# Altium project ek-ra8d2_mp - Customer.PrjPcb (part 5 of 5)
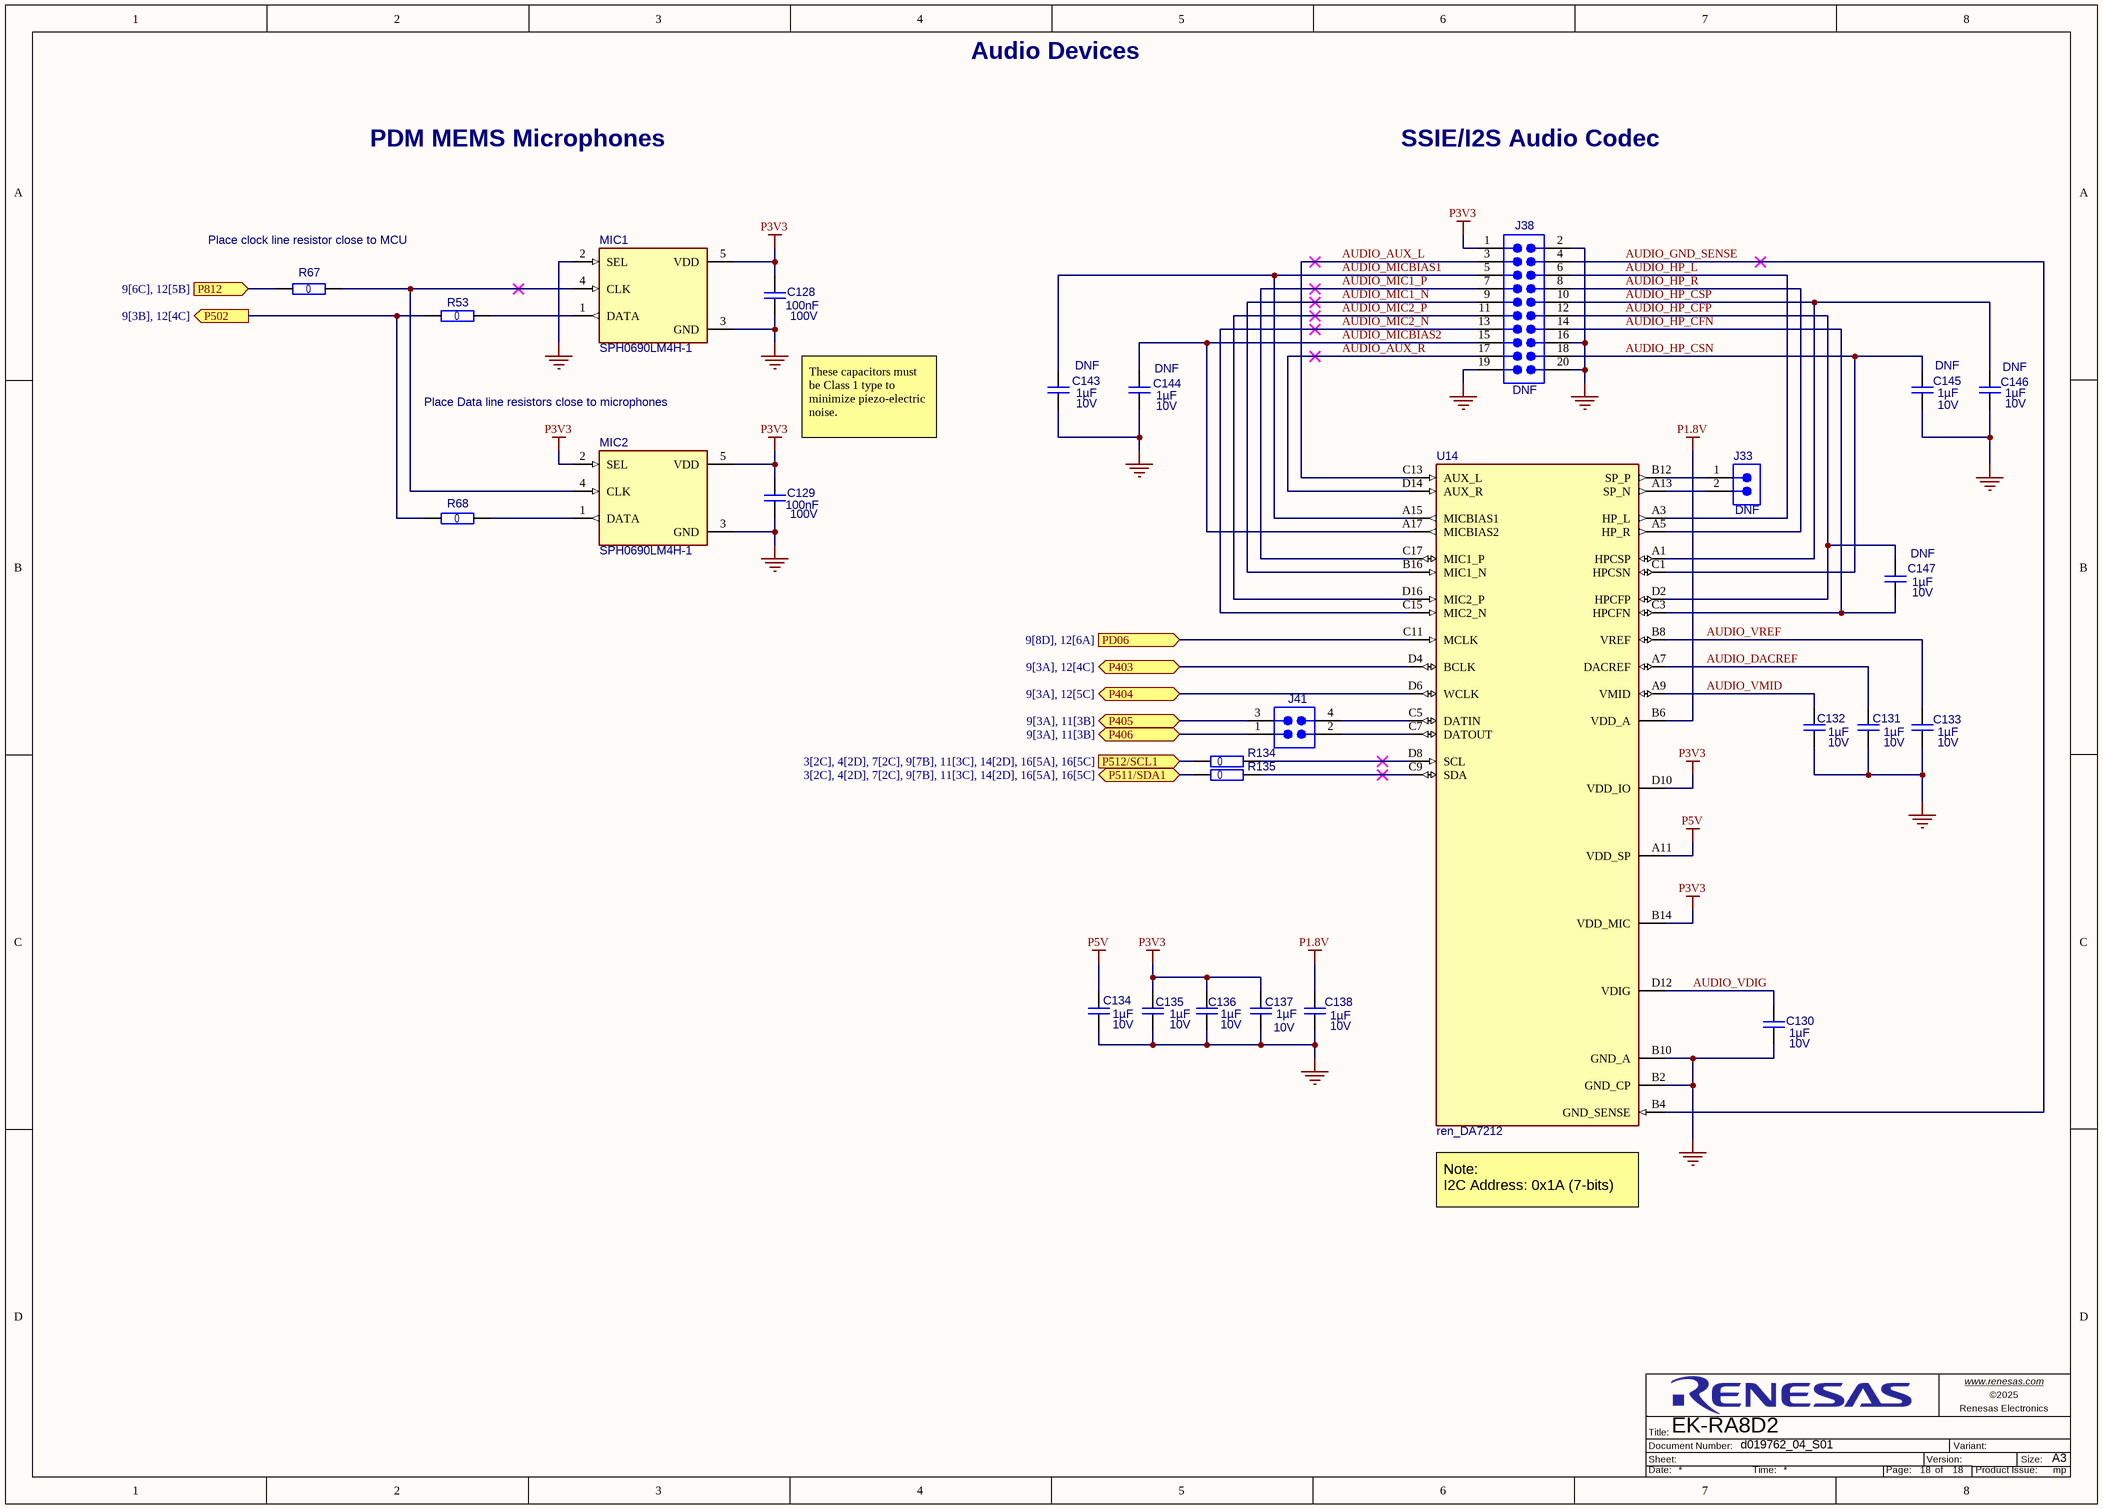
[diagram p18: Audio Devices.SchDoc]

## Nets that join several sheets
GND: Power Supply (23 pins), HMI Features (23 pins), USB Full Speed (34 pins), Arduino Shield Connection (6 pins), mikroBUS Connection (J21.8 J22.8), Pmod, Grove and Qwiic Connections (32 pins), J-Link On Board with RA4M2 (45 pins), RA8D2 MCU - Ports (18 pins), RA8D2 MCU - Power (71 pins), CEU Camera (28 pins), Pin Headers (J2.39 J3.39 J4.19 J17.19), Gigabit Ethernet (39 pins), USB High Speed (27 pins), Octal SPI Flash (34 pins), MIPI Interface and Parallel Display Interface (10 pins), SDRAM (29 pins), Audio Devices (24 pins)
P1.8V: Power Supply (6 pins), RA8D2 MCU - Power (C48.1 R86.1), MIPI Interface and Parallel Display Interface (J32.21 J32.22), Audio Devices (C138.1 U14.B6)
P3V3: Power Supply (13 pins), HMI Features (18 pins), USB Full Speed (9 pins), Arduino Shield Connection (C36.2 J18.2 J18.4 U5.20), mikroBUS Connection (J21.7), Pmod, Grove and Qwiic Connections (21 pins), J-Link On Board with RA4M2 (J13.1 J20.1 R15.2), RA8D2 MCU - Ports (9 pins), RA8D2 MCU - Power (5 pins), CEU Camera (9 pins), Pin Headers (J2.1 J3.1 J4.1 J17.1), Gigabit Ethernet (20 pins), USB High Speed (7 pins), Octal SPI Flash (30 pins), MIPI Interface and Parallel Display Interface (J1.5 J1.7 J32.23 J32.24), SDRAM (65 pins), Audio Devices (11 pins)
P3V3_MCU: RA8D2 MCU - Power (26 pins), Pin Headers (J2.40)
P3V3_USB: RA8D2 MCU - Power (8 pins), Pin Headers (J3.2)
P3V3JLOB: Power Supply (E29.2), J-Link On Board with RA4M2 (19 pins)
P5V: Power Supply (15 pins), USB Full Speed (Q1.3,7 U16.5), Arduino Shield Connection (J18.5), mikroBUS Connection (J22.7), Pmod, Grove and Qwiic Connections (E35.2), Pin Headers (J4.2), USB High Speed (Q11.3,7 U17.5), MIPI Interface and Parallel Display Interface (J1.8 J32.25 J32.26), Audio Devices (C134.1 U14.A11)
P5V_USB_DBG: Power Supply (D3.2 E59.2), J-Link On Board with RA4M2 (7 pins)
USBFS_cVBUS: Power Supply (D4.2 E60.2), USB Full Speed (6 pins)
USBHS_cVBUS: Power Supply (D6.2 E61.2), USB Full Speed (R90.2), USB High Speed (5 pins)
VSS_USBHS: RA8D2 MCU - Ports (R80.1), RA8D2 MCU - Power (8 pins)
ARD_MB_MISOB: Arduino Shield Connection (J24.5 U5.15), mikroBUS Connection (J21.5)
ARD_MB_MOSIB: Arduino Shield Connection (J24.4 U5.16), mikroBUS Connection (J21.6)
ARD_MB_RSPCKB: Arduino Shield Connection (J24.6 U5.17), mikroBUS Connection (J21.4)
ARD_MB_RXD: Arduino Shield Connection (J23.1 U5.14), mikroBUS Connection (J22.3)
ARD_MB_SSLB0: Arduino Shield Connection (J24.3 U5.18), mikroBUS Connection (J21.3)
ARD_MB_TXD: Arduino Shield Connection (J23.2 U5.13), mikroBUS Connection (J22.4)
ARDUINO_AREF: Arduino Shield Connection (J24.8), RA8D2 MCU - Power (E43.2)
ARDUINO_OE_L: HMI Features (RA1.4 SW4.4 U15.7), Arduino Shield Connection (R23.1 U5.19)
AVCC0: RA8D2 MCU - Power (C9.1 C10.2 E3.1 U1.R9), Pin Headers (J4.3)
AVSS0: RA8D2 MCU - Power (C9.2 C10.1 E4.2 U1.R10), Pin Headers (J4.5)
I3C_SEL_L: HMI Features (RA1.5 SW4.5 U15.6), RA8D2 MCU - Ports (U20.1)
MIPI_CSI_CL_N: RA8D2 MCU - Ports (U21.E1), CEU Camera (J35.9 U23.15)
MIPI_CSI_CL_P: RA8D2 MCU - Ports (U21.E2), CEU Camera (J35.8 U23.16)
MIPI_CSI_DL0_N: RA8D2 MCU - Ports (U21.D2), CEU Camera (J35.12 U23.13)
MIPI_CSI_DL0_P: RA8D2 MCU - Ports (U21.D1), CEU Camera (J35.11 U23.14)
MIPI_CSI_DL1_N: RA8D2 MCU - Ports (U21.F1), CEU Camera (J35.6 U23.17)
MIPI_CSI_DL1_P: RA8D2 MCU - Ports (U21.F2), CEU Camera (J35.5 U23.18)
MIPI_DSI_CL_N: RA8D2 MCU - Ports (U21.E3), MIPI Interface and Parallel Display Interface (J32.11)
MIPI_DSI_CL_P: RA8D2 MCU - Ports (U21.E4), MIPI Interface and Parallel Display Interface (J32.9)
MIPI_DSI_DL0_N: RA8D2 MCU - Ports (U21.D4), MIPI Interface and Parallel Display Interface (J32.5)
MIPI_DSI_DL0_P: RA8D2 MCU - Ports (U21.D3), MIPI Interface and Parallel Display Interface (J32.3)
MIPI_DSI_DL1_N: RA8D2 MCU - Ports (U21.F3), MIPI Interface and Parallel Display Interface (J32.6)
MIPI_DSI_DL1_P: RA8D2 MCU - Ports (U21.F4), MIPI Interface and Parallel Display Interface (J32.4)
MIPI_SEL: HMI Features (RA1.6 SW4.6 U15.5), RA8D2 MCU - Ports (U21.A6), CEU Camera (R66.1 R70.1 U22.19 U23.19)
OSPI_OE_L: HMI Features (RA1.3 SW4.3 U15.8), Octal SPI Flash (6 pins)
P000: HMI Features (R123.1 U15.1), RA8D2 MCU - Ports (U1.U13), Pin Headers (J2.15)
P001: Arduino Shield Connection (J19.1), RA8D2 MCU - Ports (U1.T13), Pin Headers (J2.11)
P002: Pmod, Grove and Qwiic Connections (E42.1), RA8D2 MCU - Ports (U1.U14), Pin Headers (J2.10)
P003: Arduino Shield Connection (J19.3), RA8D2 MCU - Ports (U1.R12), Pin Headers (J2.14)
P004: Arduino Shield Connection (J19.4), mikroBUS Connection (J21.1), RA8D2 MCU - Ports (U1.T11), Pin Headers (J2.6)
P005: Pmod, Grove and Qwiic Connections (E41.1), RA8D2 MCU - Ports (U1.R11), Pin Headers (J2.8)
P006: Pmod, Grove and Qwiic Connections (J26.7 R137.1), RA8D2 MCU - Ports (U1.U12), Pin Headers (J2.9)
P007: Arduino Shield Connection (J19.2), RA8D2 MCU - Ports (U1.T12), Pin Headers (J2.16)
P008: HMI Features (E32.1), RA8D2 MCU - Ports (U1.U11), Pin Headers (J2.7)
P009: HMI Features (E31.1), RA8D2 MCU - Ports (U1.P11), Pin Headers (J2.18)
P010: RA8D2 MCU - Ports (U1.P10), CEU Camera (J35.28), Pin Headers (J2.17)
P011: Arduino Shield Connection (J23.3), RA8D2 MCU - Ports (U1.N10), Pin Headers (J2.20)
P012: Pmod, Grove and Qwiic Connections (J25.7 R138.1), RA8D2 MCU - Ports (U1.P9), Pin Headers (J2.25)
P013: RA8D2 MCU - Ports (U1.N9), Pin Headers (J2.26)
P014: Arduino Shield Connection (J19.5), RA8D2 MCU - Ports (U1.T8), Pin Headers (J2.4)
P015: Arduino Shield Connection (J19.6), RA8D2 MCU - Ports (U1.U8), Pin Headers (J2.5)
P100: Arduino Shield Connection (U5.5), Pin Headers (J2.2), Octal SPI Flash (U25.14)
P100_MCU: RA8D2 MCU - Ports (U1.U6), Octal SPI Flash (U13.5 U25.6)
P101: Arduino Shield Connection (U5.4), Pin Headers (J2.12), Octal SPI Flash (U25.17)
P101_MCU: RA8D2 MCU - Ports (U1.R5), Octal SPI Flash (U13.8 U25.3)
P102: Arduino Shield Connection (U5.3), Pin Headers (J2.13), Octal SPI Flash (U25.18)
P102_MCU: RA8D2 MCU - Ports (U1.P5), Octal SPI Flash (U13.9 U25.2)
P103: Arduino Shield Connection (U5.2), Pin Headers (J2.19), Octal SPI Flash (U25.16)
P103_MCU: RA8D2 MCU - Ports (U1.R4), Octal SPI Flash (U13.7 U25.4)
P104: Arduino Shield Connection (U5.9), Pin Headers (J2.22), Octal SPI Flash (U24.14)
P104_MCU: RA8D2 MCU - Ports (U1.M6), Octal SPI Flash (U12.5 U24.6)
P105: Arduino Shield Connection (U5.8), Pin Headers (J2.23), Octal SPI Flash (U24.12)
P105_MCU: RA8D2 MCU - Ports (U1.N7), Octal SPI Flash (U12.3 U24.8)
P106: Pin Headers (J2.24), Octal SPI Flash (U24.11)
P106_MCU: RA8D2 MCU - Ports (U1.N6), Octal SPI Flash (U12.2 U24.9)
P107: RA8D2 MCU - Ports (U1.N5), Pin Headers (J2.29), Gigabit Ethernet (R113.2 U11.47)
P108: RA8D2 MCU - Ports (R71.2 U1.D8 U21.A5), Pin Headers (J2.30)
P109: RA8D2 MCU - Ports (R25.2 U1.D7), Pin Headers (J2.28)
P110: Arduino Shield Connection (J24.2), RA8D2 MCU - Ports (U1.C8), Pin Headers (J2.36)
P111: RA8D2 MCU - Ports (U1.E8), MIPI Interface and Parallel Display Interface (J1.3 J32.17)
P112: RA8D2 MCU - Ports (U1.A4), SDRAM (J37.23 RA10.1 U2.N8)
P113: RA8D2 MCU - Ports (U1.A2), SDRAM (J14.24 RA9.4 U2.P9)
P114: RA8D2 MCU - Ports (U1.B3), SDRAM (J37.21 RA9.3 U2.M8)
P115: RA8D2 MCU - Ports (U1.A3), SDRAM (J37.22 RA9.2 U2.M7)
P200/NMI: RA8D2 MCU - Ports (R14.1 U1.C5), Pin Headers (J2.38)
P201/MD: HMI Features (J16.1 R31.1), mikroBUS Connection (J21.2), J-Link On Board with RA4M2 (J6.1), RA8D2 MCU - Power (U1.E6), Pin Headers (J3.14)
P206: RA8D2 MCU - Ports (U1.B15), Pin Headers (J2.35), Gigabit Ethernet (E38.1)
P207: RA8D2 MCU - Ports (U1.A17), MIPI Interface and Parallel Display Interface (J1.23)
P208: J-Link On Board with RA4M2 (J29.1), RA8D2 MCU - Ports (U1.C7), Pin Headers (J2.37)
P209: J-Link On Board with RA4M2 (J29.3), RA8D2 MCU - Ports (U1.E7), Pin Headers (J2.21)
P210: J-Link On Board with RA4M2 (J29.5), RA8D2 MCU - Ports (E51.2 U1.C6)
P210_EXT: RA8D2 MCU - Ports (E51.1), Pin Headers (J3.8)
P211: J-Link On Board with RA4M2 (J29.7), RA8D2 MCU - Ports (E52.2 U1.D6)
P211_EXT: RA8D2 MCU - Ports (E52.1), Pin Headers (J3.10)
P212: RA8D2 MCU - Power (E13.1), Pin Headers (J3.6)
P213: RA8D2 MCU - Power (E12.1), Pin Headers (J3.5)
P214: RA8D2 MCU - Power (E58.1), Pin Headers (J17.9)
P215: RA8D2 MCU - Power (E57.1), Pin Headers (J17.12)
P300: RA8D2 MCU - Ports (U1.B5), SDRAM (J37.26 RA10.2 U2.R9)
P301: RA8D2 MCU - Ports (U1.C4), SDRAM (J37.17 RA10.3 U2.N7)
P302: RA8D2 MCU - Ports (U1.A5), SDRAM (J37.25 RA10.4 U2.R8)
P303: HMI Features (E26.1), RA8D2 MCU - Ports (U1.B6), Pin Headers (J3.33)
P304: J-Link On Board with RA4M2 (E44.1), RA8D2 MCU - Ports (R59.1), Pin Headers (J3.34), Gigabit Ethernet (E18.2)
P305: J-Link On Board with RA4M2 (E45.1), RA8D2 MCU - Ports (R60.1), Pin Headers (J3.35), Gigabit Ethernet (E19.2)
P306: J-Link On Board with RA4M2 (E46.1), RA8D2 MCU - Ports (R61.1), Pin Headers (J3.36), Gigabit Ethernet (E20.2)
P307: J-Link On Board with RA4M2 (E47.1), RA8D2 MCU - Ports (R62.1), Pin Headers (J3.37), Gigabit Ethernet (E21.2)
P308: J-Link On Board with RA4M2 (E48.1), RA8D2 MCU - Ports (U1.C9), Pin Headers (J3.32)
P309: RA8D2 MCU - Ports (R63.1), Pin Headers (J17.2), Gigabit Ethernet (E23.2)
P310: RA8D2 MCU - Ports (R64.1), Pin Headers (J3.40), Gigabit Ethernet (E22.2)
P311: RA8D2 MCU - Ports (R11.2 U1.B12), Pin Headers (J17.3)
P312: Arduino Shield Connection (J23.8), RA8D2 MCU - Ports (U1.C13), Pin Headers (J17.4)
P400: RA8D2 MCU - Ports (U20.3), CEU Camera (U23.9), Pin Headers (J17.6)
P401: RA8D2 MCU - Ports (U20.6), Pin Headers (J17.5)
P402: Pmod, Grove and Qwiic Connections (J26.8), RA8D2 MCU - Ports (U1.L14), Pin Headers (J17.14)
P403: RA8D2 MCU - Ports (U1.H13), Pin Headers (J17.7), Audio Devices (U14.D4)
P404: RA8D2 MCU - Ports (U1.J13), Pin Headers (J17.10), Audio Devices (U14.D6)
P405: RA8D2 MCU - Ports (U1.G12), CEU Camera (U23.7), Audio Devices (J41.3)
P406: RA8D2 MCU - Ports (U1.F14), CEU Camera (U23.6), Audio Devices (J41.1)
P407: USB Full Speed (U19.3 U19.6), RA8D2 MCU - Ports (U1.R17), Pin Headers (J17.11)
P408: USB Full Speed (U19.8 U19.11), RA8D2 MCU - Ports (U1.M15), Pin Headers (J17.18)
P409: Pmod, Grove and Qwiic Connections (J25.9), RA8D2 MCU - Ports (U1.R16), Pin Headers (J17.13)
P410: Pmod, Grove and Qwiic Connections (J25.8), RA8D2 MCU - Ports (U1.K13), Pin Headers (J17.16)
P411: RA8D2 MCU - Ports (U1.M14), Pin Headers (J17.15), MIPI Interface and Parallel Display Interface (J32.10)
P412: Pmod, Grove and Qwiic Connections (J26.9), RA8D2 MCU - Ports (U1.M12), Pin Headers (J17.17)
P413: Pmod, Grove and Qwiic Connections (J26.10), RA8D2 MCU - Ports (U1.P14), Pin Headers (J17.8)
P414: RA8D2 MCU - Ports (U1.L13), Pin Headers (J17.20), Gigabit Ethernet (R119.2 U11.42)
P415: RA8D2 MCU - Ports (U1.R15), Pin Headers (J4.17), Gigabit Ethernet (U11.41)
P500: USB Full Speed (Q2.1 R55.2 U19.4), RA8D2 MCU - Ports (U1.U7), Pin Headers (J4.16)
P501: RA8D2 MCU - Ports (U1.R8), CEU Camera (J35.26), Pin Headers (J4.18)
P502: RA8D2 MCU - Ports (U1.T7), Pin Headers (J4.15), Audio Devices (R53.1 R68.1)
P503: RA8D2 MCU - Ports (U1.H2), SDRAM (J37.14 RA18.1)
P504: RA8D2 MCU - Ports (U1.H1), SDRAM (J37.13 RA17.2)
P505: RA8D2 MCU - Ports (U1.H3), SDRAM (J14.15 RA17.1)
P506: RA8D2 MCU - Ports (U1.J1), SDRAM (J37.11 RA17.4)
P507: RA8D2 MCU - Ports (U1.J2), SDRAM (J37.12 RA17.3)
P508: RA8D2 MCU - Ports (U1.J3), SDRAM (J14.14 RA16.3)
P509: RA8D2 MCU - Ports (U1.J4), SDRAM (J14.13 RA16.2)
P510: RA8D2 MCU - Ports (U1.K3), SDRAM (J14.10 RA16.1)
P511/SDA1: HMI Features (R127.2), USB Full Speed (R129.2), Pmod, Grove and Qwiic Connections (E40.2 R131.1 U9.12), RA8D2 MCU - Ports (R26.1 U1.U15 U20.9), CEU Camera (J35.21), USB High Speed (R133.2), MIPI Interface and Parallel Display Interface (J1.2 J32.14), Audio Devices (R135.2)
P512/SCL1: HMI Features (R13.2), USB Full Speed (R128.2), Pmod, Grove and Qwiic Connections (E39.2 R130.1 U9.9), RA8D2 MCU - Ports (R28.1 U1.P13 U20.12), CEU Camera (J35.20), USB High Speed (R132.2), MIPI Interface and Parallel Display Interface (J1.4 J32.16), Audio Devices (R134.2)
P513: RA8D2 MCU - Ports (U1.R13), MIPI Interface and Parallel Display Interface (J1.14)
P514: RA8D2 MCU - Ports (U1.R14), MIPI Interface and Parallel Display Interface (J1.1 J32.15)
P515: RA8D2 MCU - Ports (U1.P15), MIPI Interface and Parallel Display Interface (J1.10)
P600: HMI Features (E27.1), RA8D2 MCU - Ports (U1.P3), Pin Headers (J4.10)
P601: Pmod, Grove and Qwiic Connections (E16.2), RA8D2 MCU - Ports (U1.P4), Pin Headers (J4.12)
P602: Pmod, Grove and Qwiic Connections (J25.3), RA8D2 MCU - Ports (U1.P2), Pin Headers (J4.8)
P603: Pmod, Grove and Qwiic Connections (J25.2), RA8D2 MCU - Ports (U1.P1), Pin Headers (J4.4)
P604: Pmod, Grove and Qwiic Connections (E14.2 E15.2), RA8D2 MCU - Ports (U1.N2), Pin Headers (J4.6)
P605: Pmod, Grove and Qwiic Connections (E10.2), RA8D2 MCU - Ports (U1.N1), Pin Headers (J4.14)
P606: RA8D2 MCU - Ports (U1.N3), MIPI Interface and Parallel Display Interface (J1.6 J32.18)
P607: RA8D2 MCU - Ports (U1.M2), SDRAM (J37.2 RA3.1 U2.E2)
P608: RA8D2 MCU - Ports (U1.K2), SDRAM (J37.9 RA16.4)
P609: RA8D2 MCU - Ports (U1.A1), SDRAM (J14.22 RA9.1 U2.L8)
P610: RA8D2 MCU - Ports (U1.D3), SDRAM (J14.23 RA7.4 U2.N2)
P611: RA8D2 MCU - Ports (U1.D2), SDRAM (J14.19 RA7.3 U2.R1)
P612: RA8D2 MCU - Ports (U1.E4), SDRAM (J14.21 RA7.2 U2.N3)
P613: RA8D2 MCU - Ports (U1.C2), SDRAM (J37.20 RA7.1 U2.R2)
P614: RA8D2 MCU - Ports (U1.E3), SDRAM (J14.20 U2.K9)
P615: RA8D2 MCU - Ports (U1.E2), SDRAM (J37.18 U2.F8)
P700: RA8D2 MCU - Ports (U1.F12), CEU Camera (U23.5), Pin Headers (J3.9)
P701: RA8D2 MCU - Ports (U1.F15), CEU Camera (U23.4), Pin Headers (J3.12)
P702: RA8D2 MCU - Ports (U1.F13), CEU Camera (U23.3), Pin Headers (J3.13)
P703: RA8D2 MCU - Ports (U1.G14), CEU Camera (U23.2), Pin Headers (J3.11)
P704: Pmod, Grove and Qwiic Connections (J25.10), RA8D2 MCU - Ports (U1.G13), Pin Headers (J3.38)
P705: RA8D2 MCU - Ports (U1.F17), Pin Headers (J3.7)
P706: RA8D2 MCU - Ports (U1.E17), Pin Headers (J3.31)
P707: RA8D2 MCU - Ports (U1.F16), MIPI Interface and Parallel Display Interface (J1.34)
P708: RA8D2 MCU - Ports (U1.N12), Pin Headers (J4.20), Gigabit Ethernet (R139.2 U11.16)
P709: RA8D2 MCU - Ports (U1.P16), CEU Camera (J35.25)
P710: RA8D2 MCU - Ports (U1.M13), MIPI Interface and Parallel Display Interface (J1.13)
P711: RA8D2 MCU - Ports (U1.N15), MIPI Interface and Parallel Display Interface (J1.33)
P712: RA8D2 MCU - Ports (U1.N13), MIPI Interface and Parallel Display Interface (J1.36)
P713: RA8D2 MCU - Ports (U1.N16), MIPI Interface and Parallel Display Interface (J1.35)
P714: RA8D2 MCU - Ports (U1.N14), MIPI Interface and Parallel Display Interface (J1.38)
P715: RA8D2 MCU - Ports (U1.T15), MIPI Interface and Parallel Display Interface (J1.37)
P800: Pmod, Grove and Qwiic Connections (U9.2), Pin Headers (J3.22), Octal SPI Flash (U25.15)
P800_MCU: RA8D2 MCU - Ports (U1.T6), Octal SPI Flash (U13.6 U25.5)
P801: Pmod, Grove and Qwiic Connections (U6.5), Pin Headers (J3.19), Octal SPI Flash (U24.15)
P801_MCU: RA8D2 MCU - Ports (U1.P6), Octal SPI Flash (U12.6 U24.5)
P802: Pmod, Grove and Qwiic Connections (U6.9), Pin Headers (J3.18), Octal SPI Flash (U25.13)
P802_MCU: RA8D2 MCU - Ports (U1.R6), Octal SPI Flash (U13.4 U25.7)
P803: Pmod, Grove and Qwiic Connections (U6.12), Pin Headers (J3.17), Octal SPI Flash (U25.12)
P803_MCU: RA8D2 MCU - Ports (U1.P7), Octal SPI Flash (U13.3 U25.8)
P804: Pmod, Grove and Qwiic Connections (R136.1 U6.2 U9.5), Pin Headers (J3.20), Octal SPI Flash (U25.11)
P804_MCU: RA8D2 MCU - Ports (U1.R7), Octal SPI Flash (U13.2 U25.9)
P805: RA8D2 MCU - Ports (U1.P12), MIPI Interface and Parallel Display Interface (J1.12)
P806: RA8D2 MCU - Ports (U1.T14), MIPI Interface and Parallel Display Interface (J1.9)
P807: RA8D2 MCU - Ports (U1.N11), MIPI Interface and Parallel Display Interface (J1.11)
P808: Arduino Shield Connection (U5.6), Pin Headers (J3.16), Octal SPI Flash (U24.13)
P808_MCU: RA8D2 MCU - Ports (U1.U5), Octal SPI Flash (U12.4 U24.7)
P809: Arduino Shield Connection (U5.7), RA8D2 MCU - Ports (U1.T5), Pin Headers (J3.15)
P810: Arduino Shield Connection (J23.5), mikroBUS Connection (J22.1), RA8D2 MCU - Ports (U1.M9), Pin Headers (J3.24)
P811: Arduino Shield Connection (J23.4), RA8D2 MCU - Ports (U1.N8), Pin Headers (J3.21)
P812: RA8D2 MCU - Ports (U1.P8), Pin Headers (J3.23), Audio Devices (R67.1)
P813: RA8D2 MCU - Ports (U1.B1), SDRAM (E50.2)
P902: RA8D2 MCU - Ports (U1.E9), CEU Camera (U23.8), MIPI Interface and Parallel Display Interface (J1.17)
P903: RA8D2 MCU - Ports (U1.D9), MIPI Interface and Parallel Display Interface (J1.18)
P904: RA8D2 MCU - Ports (U1.A16), MIPI Interface and Parallel Display Interface (J1.24)
P905: RA8D2 MCU - Ports (U1.A14), Pin Headers (J3.25), Gigabit Ethernet (E37.1)
P906: RA8D2 MCU - Ports (U1.A13), Pin Headers (J3.26), Gigabit Ethernet (E36.1)
P907: RA8D2 MCU - Ports (U1.A15), Pin Headers (J3.27), Gigabit Ethernet (E34.1)
P908: RA8D2 MCU - Ports (U1.B13), Pin Headers (J3.28), Gigabit Ethernet (E33.1)
P909: RA8D2 MCU - Ports (U1.B14), Pin Headers (J3.29), Gigabit Ethernet (E24.1)
P910: RA8D2 MCU - Ports (U1.E11), MIPI Interface and Parallel Display Interface (J1.20)
P911: RA8D2 MCU - Ports (U1.C12), MIPI Interface and Parallel Display Interface (J1.19)
P912: RA8D2 MCU - Ports (U1.D12), MIPI Interface and Parallel Display Interface (J1.22)
P913: RA8D2 MCU - Ports (U1.E12), MIPI Interface and Parallel Display Interface (J1.21)
P914: RA8D2 MCU - Ports (U1.E5), MIPI Interface and Parallel Display Interface (J1.16)
P915: RA8D2 MCU - Ports (U1.A6), MIPI Interface and Parallel Display Interface (J1.15)
PA00: RA8D2 MCU - Ports (U1.G1), SDRAM (J37.16 RA18.2)
PA01: RA8D2 MCU - Ports (U1.H4), SDRAM (J14.16 RA18.3)
PA02: RA8D2 MCU - Ports (U1.F1), SDRAM (J14.17 RA18.4)
PA03: RA8D2 MCU - Ports (U1.G2), SDRAM (J37.15 RA19.1)
PA04: RA8D2 MCU - Ports (U1.D1), SDRAM (J37.7 U2.F2)
PA05: RA8D2 MCU - Ports (U1.G3), SDRAM (J14.18 U2.K1)
PA06: RA8D2 MCU - Ports (U1.C1), SDRAM (U2.J2)
PA07: HMI Features (E28.1), RA8D2 MCU - Ports (U1.G4), Pin Headers (J3.30)
PA08: RA8D2 MCU - Ports (U1.F3), SDRAM (RA2.1 U2.K8)
PA09: RA8D2 MCU - Ports (U1.F4), SDRAM (RA2.2 U2.K7)
PA10: RA8D2 MCU - Ports (U1.F2), SDRAM (RA2.3 U2.J9)
PA11: RA8D2 MCU - Ports (U1.B4), SDRAM (J37.24 RA8.4 U2.L2)
PA12: RA8D2 MCU - Ports (U1.B2), SDRAM (J37.19 RA8.3 U2.M3)
PA13: RA8D2 MCU - Ports (U1.C3), SDRAM (J14.25 RA8.2 U2.M2)
PA14: RA8D2 MCU - Ports (U1.D4), SDRAM (J14.26 RA8.1 U2.P1)
PA15: RA8D2 MCU - Ports (U1.E1), SDRAM (U2.J1)
PB00: RA8D2 MCU - Ports (U1.E16), MIPI Interface and Parallel Display Interface (J1.31)
PB01: RA8D2 MCU - Ports (U1.D17), MIPI Interface and Parallel Display Interface (J1.27)
PB02: RA8D2 MCU - Ports (U1.E13), CEU Camera (U22.6), MIPI Interface and Parallel Display Interface (J1.32)
PB03: RA8D2 MCU - Ports (U1.D16), CEU Camera (U22.7), MIPI Interface and Parallel Display Interface (J1.29)
PB04: RA8D2 MCU - Ports (U1.D13), CEU Camera (U22.9), MIPI Interface and Parallel Display Interface (J1.30)
PB05: RA8D2 MCU - Ports (U1.D15), MIPI Interface and Parallel Display Interface (J1.28)
PB06: RA8D2 MCU - Ports (U1.E14), MIPI Interface and Parallel Display Interface (J1.25)
PB07: RA8D2 MCU - Ports (U1.D14), MIPI Interface and Parallel Display Interface (J1.26)
PC00: RA8D2 MCU - Ports (U1.M1), SDRAM (J14.2 RA3.2 U2.D3)
PC01: RA8D2 MCU - Ports (U1.M3), SDRAM (J14.6 RA3.3 U2.D2)
PC02: RA8D2 MCU - Ports (U1.L2), SDRAM (J14.4 RA3.4 U2.B1)
PC03: RA8D2 MCU - Ports (U1.L1), SDRAM (J37.8 RA4.1 U2.C2)
PC04: RA8D2 MCU - Ports (U1.L3), SDRAM (J14.8 RA4.2 U2.A1)
PC05: RA8D2 MCU - Ports (U1.L5), SDRAM (J37.3 RA4.3 U2.C3)
PC06: RA8D2 MCU - Ports (U1.N4), SDRAM (J14.3 RA4.4 U2.A2)
PC07: RA8D2 MCU - Ports (U1.K5), SDRAM (J14.11 RA5.1 U2.A8)
PC08: RA8D2 MCU - Ports (U1.M4), SDRAM (J14.5 RA5.2 U2.C7)
PC09: RA8D2 MCU - Ports (U1.L4), SDRAM (J14.7 RA5.3 U2.A9)
PC10: RA8D2 MCU - Ports (U1.M5), SDRAM (J37.1 RA5.4 U2.C8)
PC11: RA8D2 MCU - Ports (U1.H5), SDRAM (J37.4 RA6.1 U2.B9)
PC12: RA8D2 MCU - Ports (U1.G5), SDRAM (J37.6 RA6.2 U2.D8)
PC13: RA8D2 MCU - Ports (U1.J5), SDRAM (J14.12 RA6.3 U2.D7)
PC14: RA8D2 MCU - Ports (U1.F5), SDRAM (J37.5 RA6.4 U2.E8)
PC15: RA8D2 MCU - Ports (U1.K1), SDRAM (J37.10 RA19.3)
PD00: RA8D2 MCU - Ports (U1.K4), SDRAM (J14.9 RA19.2)
PD01: Arduino Shield Connection (J24.1), mikroBUS Connection (J22.2), RA8D2 MCU - Ports (U1.B16), Pin Headers (J2.34)
PD02: J-Link On Board with RA4M2 (U7.23), RA8D2 MCU - Ports (U1.B17), Pin Headers (J2.33)
PD03: J-Link On Board with RA4M2 (R118.1), RA8D2 MCU - Ports (U1.C15), Pin Headers (J2.31)
PD04: J-Link On Board with RA4M2 (E17.1), RA8D2 MCU - Ports (U1.C14), Pin Headers (J2.32)
PD05: J-Link On Board with RA4M2 (E9.1), RA8D2 MCU - Ports (U1.C16), Pin Headers (J2.27)
PD06: RA8D2 MCU - Ports (U1.C17), Pin Headers (J3.4), Audio Devices (U14.C11)
PD07: USB Full Speed (U19.13), RA8D2 MCU - Ports (U1.E15), Pin Headers (J3.3), USB High Speed (Q3.1 R57.2)
PMOD1_MD_SEL0: HMI Features (RA1.1 SW4.1 U15.12), Pmod, Grove and Qwiic Connections (U10.6)
PMOD1_MD_SEL1: HMI Features (RA1.2 SW4.2 U15.11), Pmod, Grove and Qwiic Connections (U10.7)
RESET_L: HMI Features (C68.2 R38.1 SW3.3 SW3.4), USB Full Speed (J31.3 U4.25), Arduino Shield Connection (J18.3), J-Link On Board with RA4M2 (J8.2), RA8D2 MCU - Power (U1.D5), Pin Headers (J2.3), USB High Speed (U18.25)
SCL: Arduino Shield Connection (J24.10), mikroBUS Connection (J22.5), Pmod, Grove and Qwiic Connections (J27.1 J30.4), RA8D2 MCU - Ports (E54.2 R11.1 U20.2)
SDA: Arduino Shield Connection (J24.9), mikroBUS Connection (J22.6), Pmod, Grove and Qwiic Connections (J27.2 J30.3), RA8D2 MCU - Ports (E53.2 R25.1 U20.5)
USBFS_N: USB Full Speed (FL2.3), RA8D2 MCU - Ports (U1.T16)
USBFS_P: USB Full Speed (FL2.2), RA8D2 MCU - Ports (U1.U16)
USBFS_ROLE_SW: HMI Features (RA1.7 SW4.7 U15.4), USB Full Speed (U4.24)
USBHS_N: RA8D2 MCU - Ports (U1.H17), USB High Speed (FL1.3)
USBHS_P: RA8D2 MCU - Ports (U1.H16), USB High Speed (FL1.2)
USBHS_PD_ATT_UFP: USB Full Speed (U19.12), USB High Speed (U18.13)
USBHS_PD_TOOL0: USB Full Speed (J31.5), USB High Speed (R88.1 U18.7)
USBHS_ROLE_SW: HMI Features (RA1.8 SW4.8 U15.3), USB High Speed (U18.24)
USBHS_VBUS_SEL: USB Full Speed (U19.10), USB High Speed (Q3.3 R56.1)
VREFH: RA8D2 MCU - Power (C8.1 E2.1 E43.1 U1.U9), Pin Headers (J4.7)
VREFH0: RA8D2 MCU - Power (C11.1 E6.1 U1.U10), Pin Headers (J4.11)
VREFL: RA8D2 MCU - Power (C8.2 E1.2 U1.T9), Pin Headers (J4.9)
VREFL0: RA8D2 MCU - Power (C11.2 E5.2 U1.T10), Pin Headers (J4.13)

## Assembly variants
customer: not fitted C108 C139 C143 C144 C145 C146 C147 C162 J2 J3 J4 J5 J12 J14 J17 J21 J22 J27 J28 J30 J31 J33 J34 J36 J37 J38 J60 R23 R66 R70 R74 R75 R87 R108; alternate parts U7 -> ICS-00000006-18